# Altium schematic sheet Sheet1.SchDoc
size A4; SheetNumber: 2; SheetTotal: 3
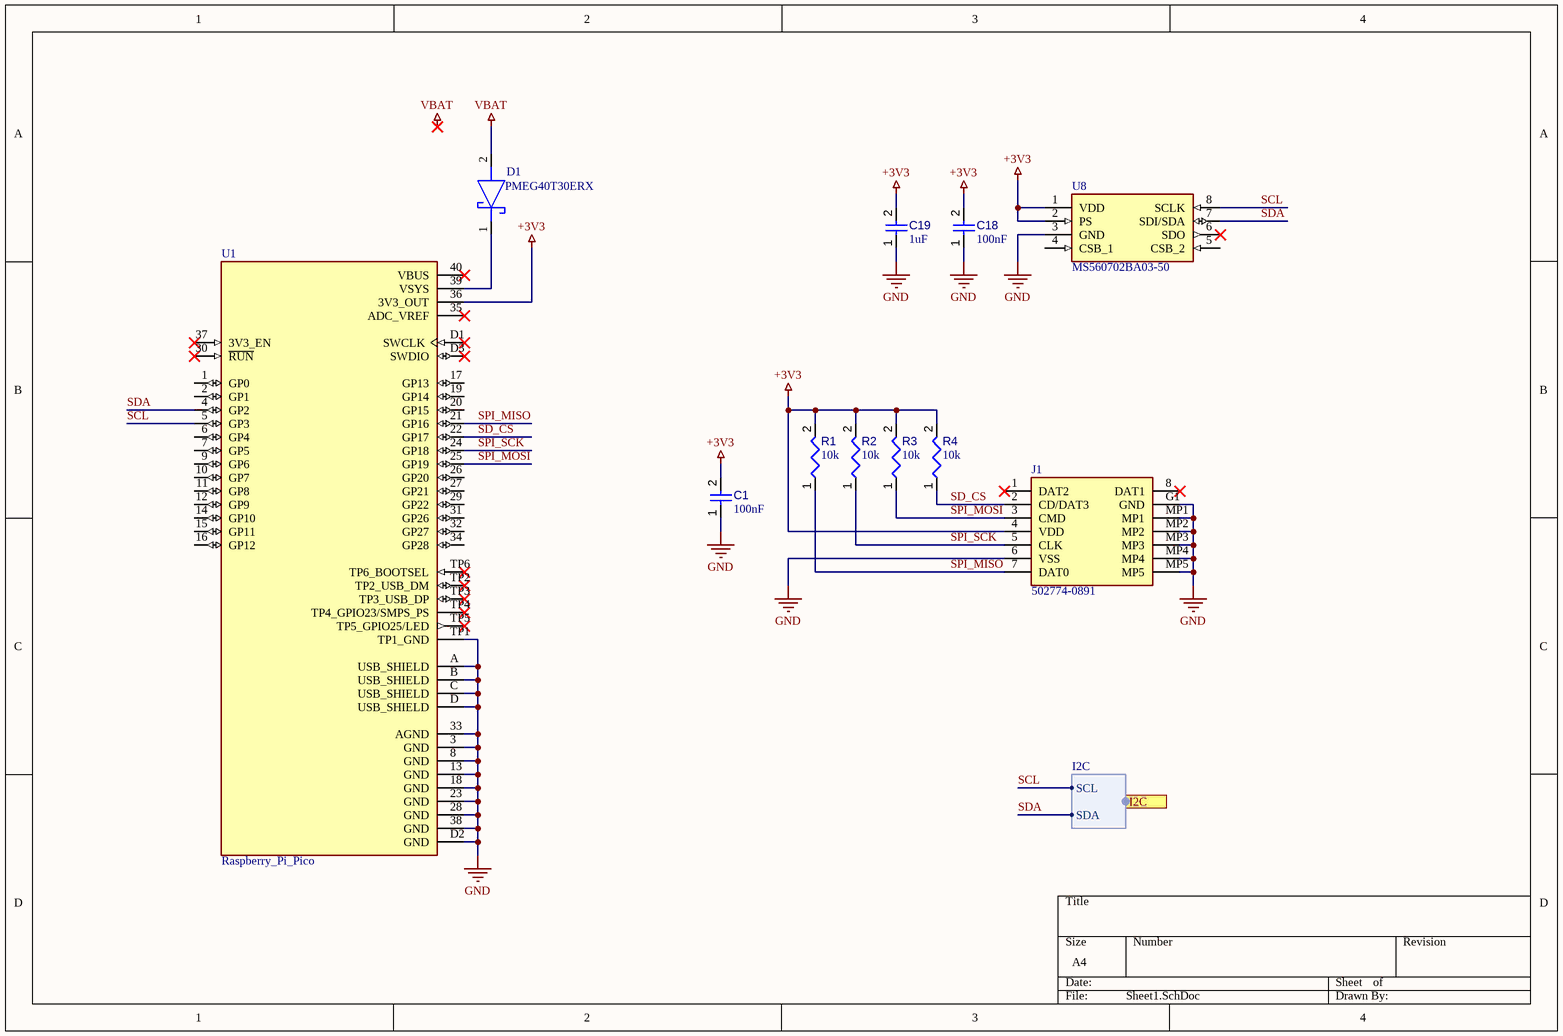
[diagram p0: Sheet1.SchDoc]

## Parts
C1  value 100nF  [CAPC1608X90X40NL10T20]  (hidden comment: Capacitor 100 nF +/-10% 50 V 0603)
C18  value 100nF  [CAPC1608X90X40NL10T20]  (hidden comment: Capacitor 100 nF +/-10% 50 V 0603)
C19  value 1uF  [CAPC1608X90X40NL10T20]  (hidden comment: Capacitor 100 nF +/-10% 50 V 0603)
D1  PMEG40T30ERX  [SODFL3517X110N]
J1  502774-0891  [5027740891]
R1  value 10k  [RESC1608X55X25ML10T15]  (hidden comment: Resistor 10k +/-1% 0603 100 mW)
R2  value 10k  [RESC1608X55X25ML10T15]  (hidden comment: Resistor 10k +/-1% 0603 100 mW)
R3  value 10k  [RESC1608X55X25ML10T15]  (hidden comment: Resistor 10k +/-1% 0603 100 mW)
R4  value 10k  [RESC1608X55X25ML10T15]  (hidden comment: Resistor 10k +/-1% 0603 100 mW)
U1  Raspberry_Pi_Pico  [MODULE_SC0915]
U8  MS560702BA03-50  [MS5607-02BA03]

## Ports
I2C (harness I2C, see Main_Board[3B], Sheet2[1B])

## Harnesses
I2C: SCL, SDA

## Nets
+3V3: C1.2 C18.2 C19.2 J1.4(VDD) R1.2 R2.2 R3.2 R4.2 U1.36(3V3_OUT) U8.1(VDD) U8.2(PS)
GND: C1.1 C18.1 C19.1 J1.6(VSS) J1.G1(GND) J1.MP1 J1.MP2 J1.MP3 J1.MP4 J1.MP5 U1.3(GND) U1.8(GND) U1.13(GND) U1.18(GND) U1.23(GND) U1.28(GND) U1.33(AGND) U1.38(GND) U1.A(USB_SHIELD) U1.B(USB_SHIELD) U1.C(USB_SHIELD) U1.D(USB_SHIELD) U1.D2(GND) U1.TP1(TP1_GND) U8.3(GND)
VBAT: D1.2(A)
SCL: U1.5(GP3) U8.8(SCLK) ; port I2C.SCL
SD_CS: J1.2(CD/DAT3) R4.1 U1.22(GP17)
SDA: U1.4(GP2) U8.7(SDI/SDA) ; port I2C.SDA
SPI_MISO: J1.7(DAT0) R1.1 U1.21(GP16)
SPI_MOSI: J1.3(CMD) R3.1 U1.25(GP19)
SPI_SCK: J1.5(CLK) R2.1 U1.24(GP18)
NetD1_1: D1.1(K) U1.39(VSYS)

Not connected (* = marked no-connect by the designer): J1 1(DAT2)* 8(DAT1)*; U1 1(GP0) 2(GP1) 6(GP4) 7(GP5) 9(GP6) 10(GP7) 11(GP8) 12(GP9) 14(GP10) 15(GP11) 16(GP12) 17(GP13) 19(GP14) 20(GP15) 26(GP20) 27(GP21) 29(GP22) 30(~{RUN})* 31(GP26) 32(GP27) 34(GP28) 35(ADC_VREF)* 37(3V3_EN)* 40(VBUS)* D1(SWCLK)* D3(SWDIO)* TP2(TP2_USB_DM)* TP3(TP3_USB_DP)* TP4(TP4_GPIO23/SMPS_PS)* TP5(TP5_GPIO25/LED)* TP6(TP6_BOOTSEL)*; U8 4(CSB_1) 5(CSB_2) 6(SDO)*

## Notes on the sheet
- Labels drawn without touching a wire or pin: VBAT

## Library data of the parts
C1 C18 C19 = CMP-001-00017-6: Chip Capacitor, 100 nF, +/- 10%, 50 V, 0603 (1608 Metric); Voltage Rating: 50V; Capacitor Type: Ceramic; Tolerance: 10%; Mounting Technology: SM; Max Operating Temperature: 125°C; RoHS Compliant: True; Pins: 2; Case/Package: 0603; Min Operating Temperature: -55°C
D1 = PMEG60T30ELRX: Schottky Diode; Manufacturer_Name: Nexperia; Datasheet Link: https://assets.nexperia.com/documents/data-sheet/PMEG60T30ELR.pdf; Height: 1.1mm; Manufacturer_Part_Number: PMEG60T30ELRX; Mouser Part Number: 771-PMEG60T30ELRX; Mouser Price/Stock: https://www.mouser.co.uk/ProductDetail/Nexperia/PMEG60T30ELRX?qs=MLItCLRbWswWnbT%2FWpJcxg%3D%3D; Arrow Part Number: PMEG60T30ELRX; Arrow Price/Stock: https://www.arrow.com/en/products/pmeg60t30elrx/nexperia?region=nac
J1 = 502774-0891: Connector; Manufacturer_Name: Molex; Datasheet Link: https://www.molex.com/content/dam/molex/molex-dot-com/products/automated/en-us/salesdrawingpdf/502/502774/5027740891_sd.pdf; Height: 1.95mm; Manufacturer_Part_Number: 502774-0891; Mouser Part Number: 538-502774-0891; Mouser Price/Stock: https://www.mouser.co.uk/ProductDetail/Molex/502774-0891?qs=HaAz2OYkmGggsnJ7oFWqbQ%3D%3D
R1-R4 = CMP-009-00017-5: Chip Resistor, 10 KOhm, +/- 1%, 01 W, -55 to 155 degC, 0603 (1608 Metric); Voltage Rating: 50V; Power: 100mW; RoHS Compliant: True; Min Operating Temperature: -55°C; Pins: 2; Case/Package: 0603; Mounting Technology: SM; Max Operating Temperature: 155°C; Tolerance: 1%
U1 = CMP-090-000000-1: RP2040 Raspberry Pi Pico series ARMÂ® CortexÂ®-M0+ MCU 32-Bit Embedded Evaluation Board; MP: SC0915; Design Item ID: SC0915; Value: *; Price: None; Check_prices: https://www.snapeda.com/parts/SC0915/Raspberry+Pi/view-part/?ref=eda; Source: SC0915.SchLib; Pin Count: 53; MF: Raspberry Pi; Package: None; Availability: In Stock; SnapEDA_Link: https://www.snapeda.com/parts/SC0915/Raspberry+Pi/view-part/?ref=snap; Purchase-URL: https://pricing.snapeda.com/search/part/SC0915/?ref=eda; Component Type: Standard
U8 = MS560702BA03-50: Integrated Circuit; Manufacturer_Name: TE Connectivity; Datasheet Link: http://www.te.com/commerce/DocumentDelivery/DDEController?Action=srchrtrv&DocNm=MS5607-02BA03&DocType=Data+Sheet&DocLang=English; Manufacturer_Part_Number: MS560702BA03-50; Mouser Part Number: 824-MS560702BA03-50; Mouser Price/Stock: https://www.mouser.co.uk/ProductDetail/Measurement-Specialties/MS560702BA03-50?qs=urSpXqmdEVImCZG1H%252BT8ng%3D%3D; Arrow Part Number: MS560702BA03-50; Arrow Price/Stock: https://www.arrow.com/en/products/ms560702ba03-50/te-connectivity?region=europe